# Altium schematic sheet MainboardPCB.SchDoc
size 863 x 558 mm; SheetNumber: 1; SheetTotal: 1
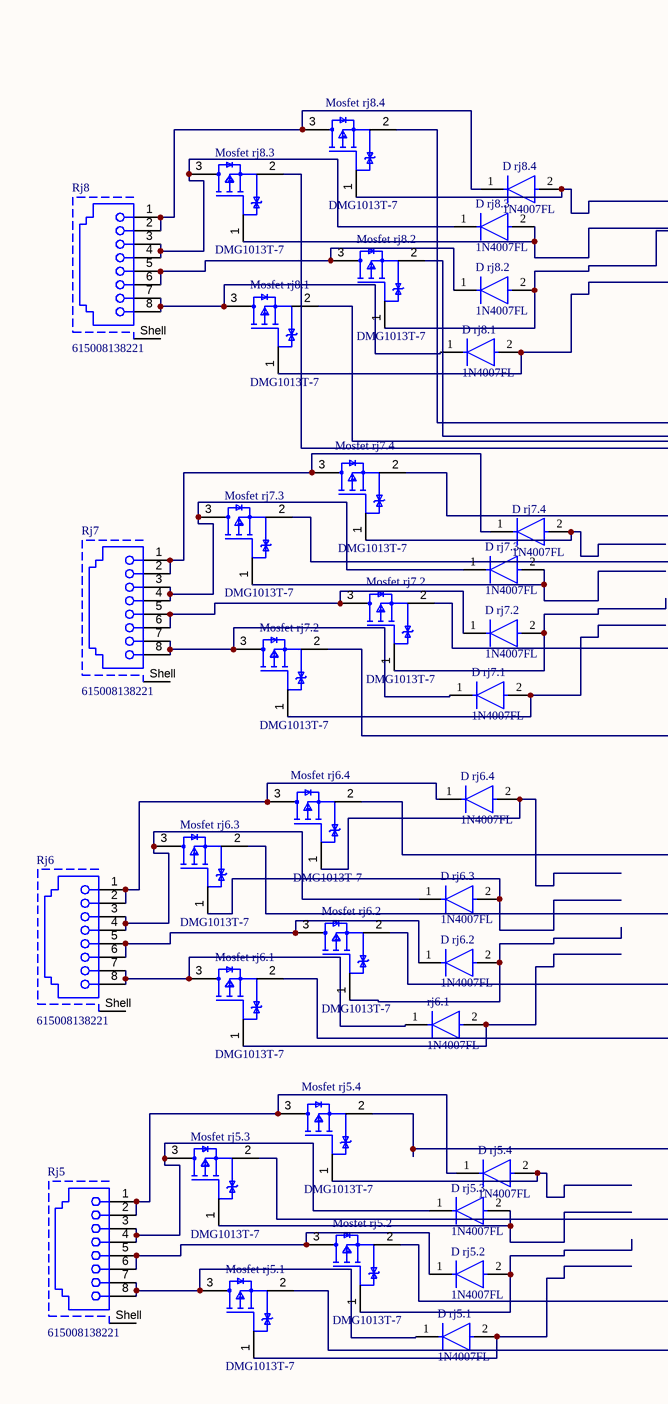
[diagram p0: MainboardPCB.SchDoc, top left]
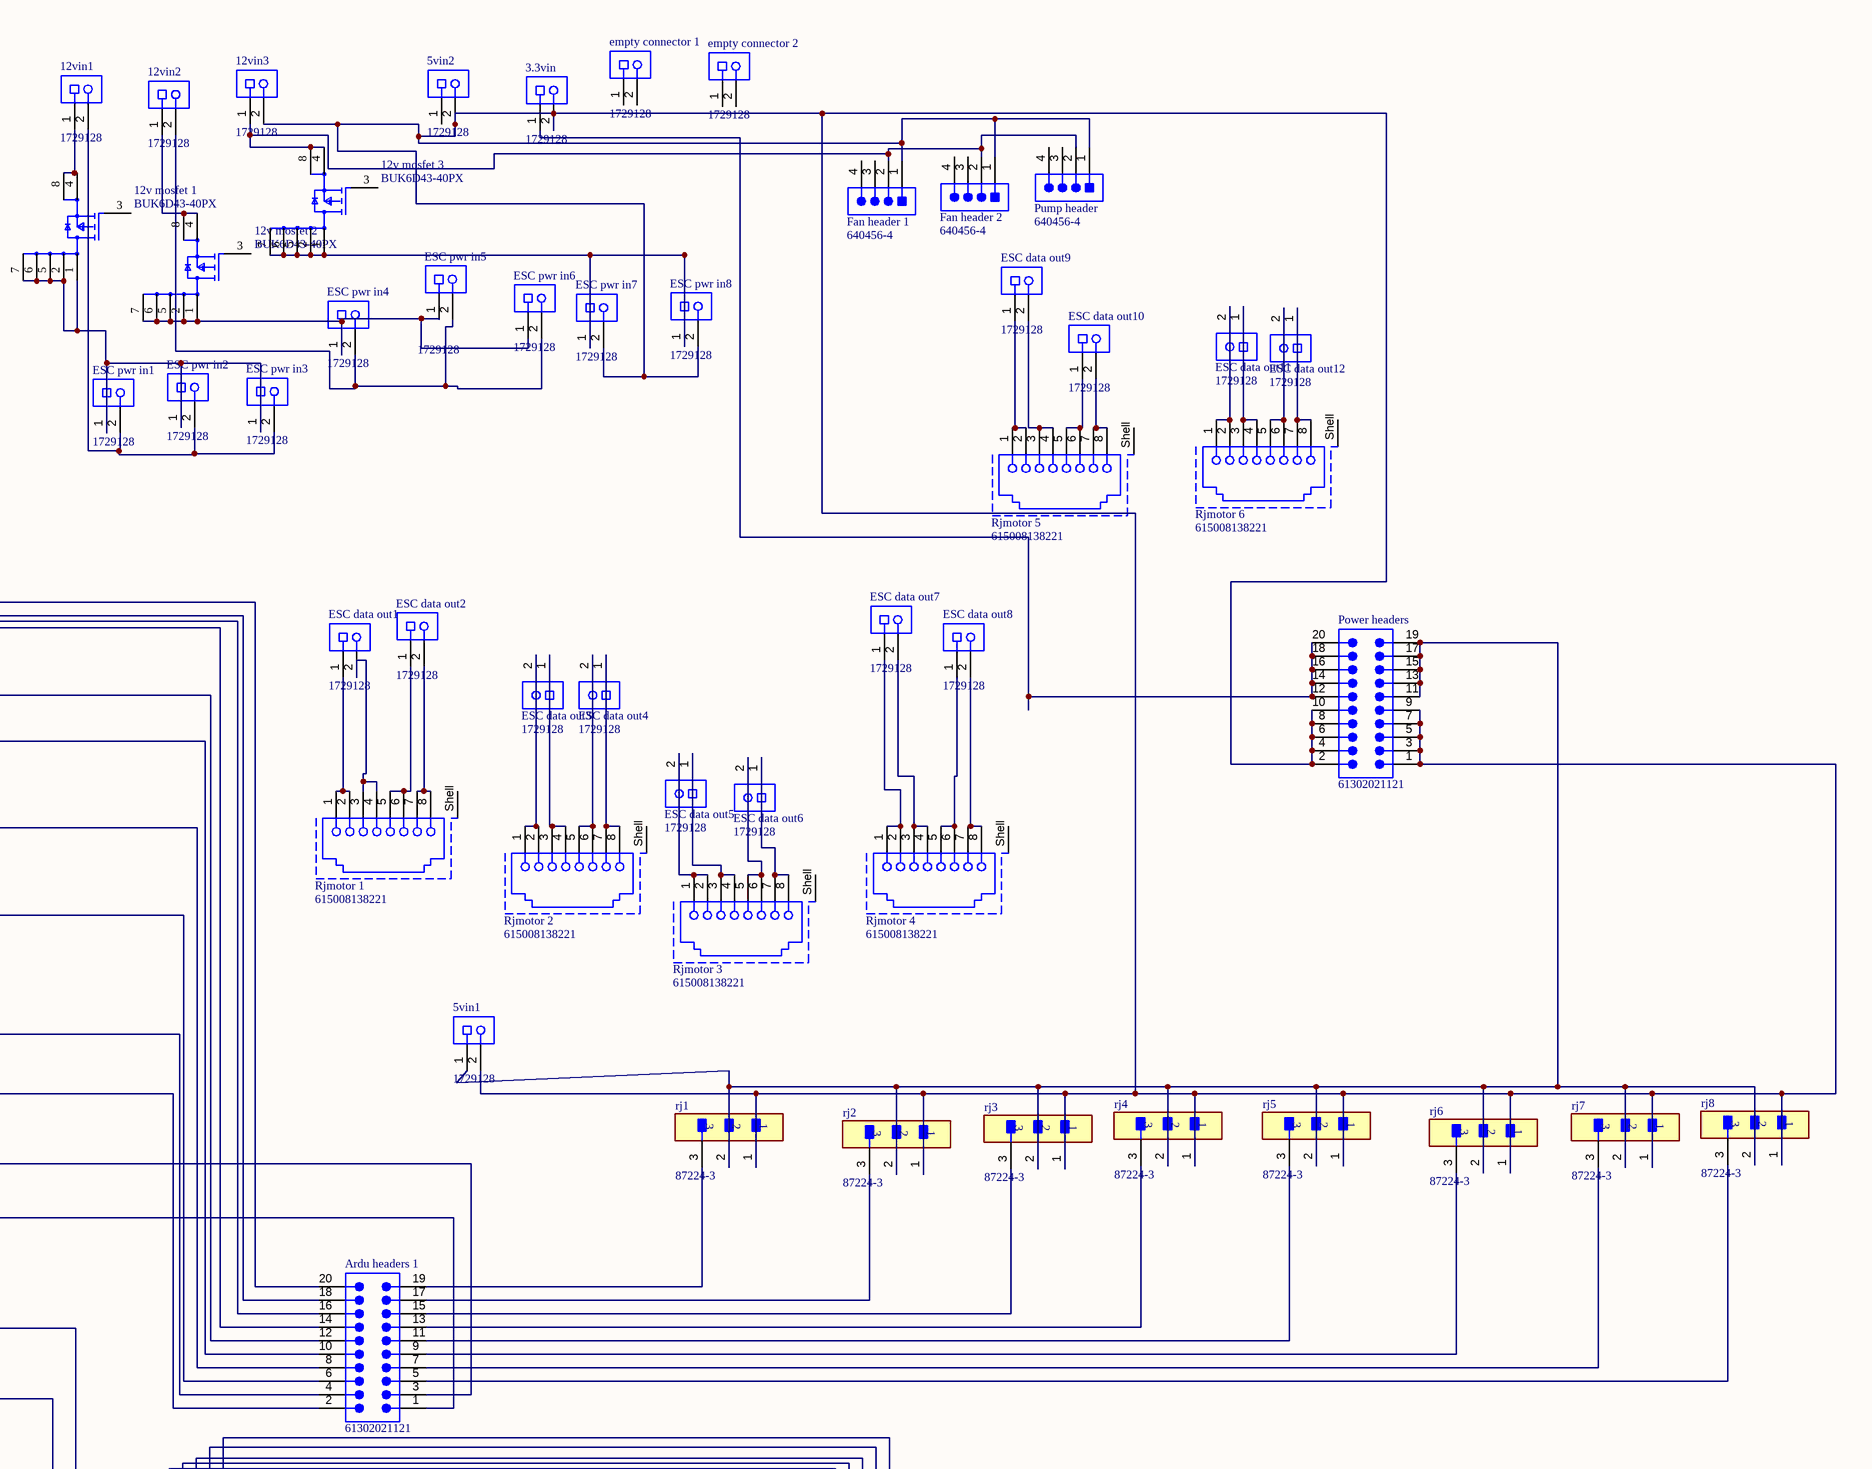
[diagram p1: MainboardPCB.SchDoc, top right]
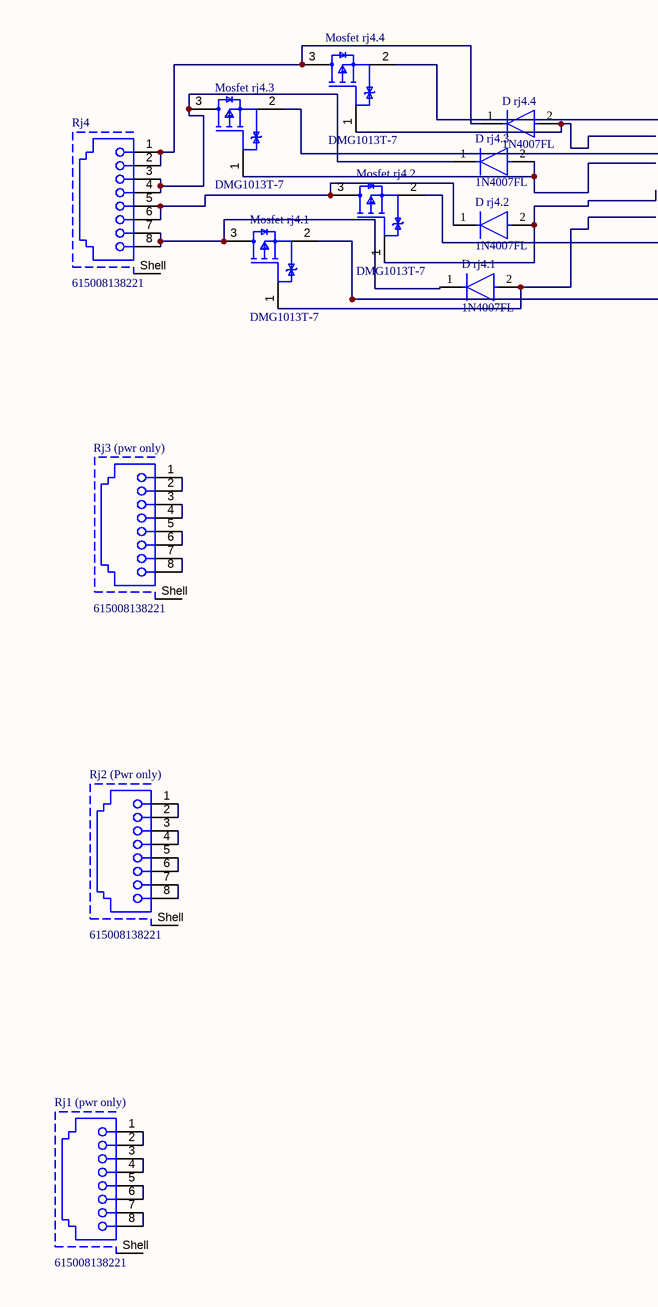
[diagram p2: MainboardPCB.SchDoc, bottom left]
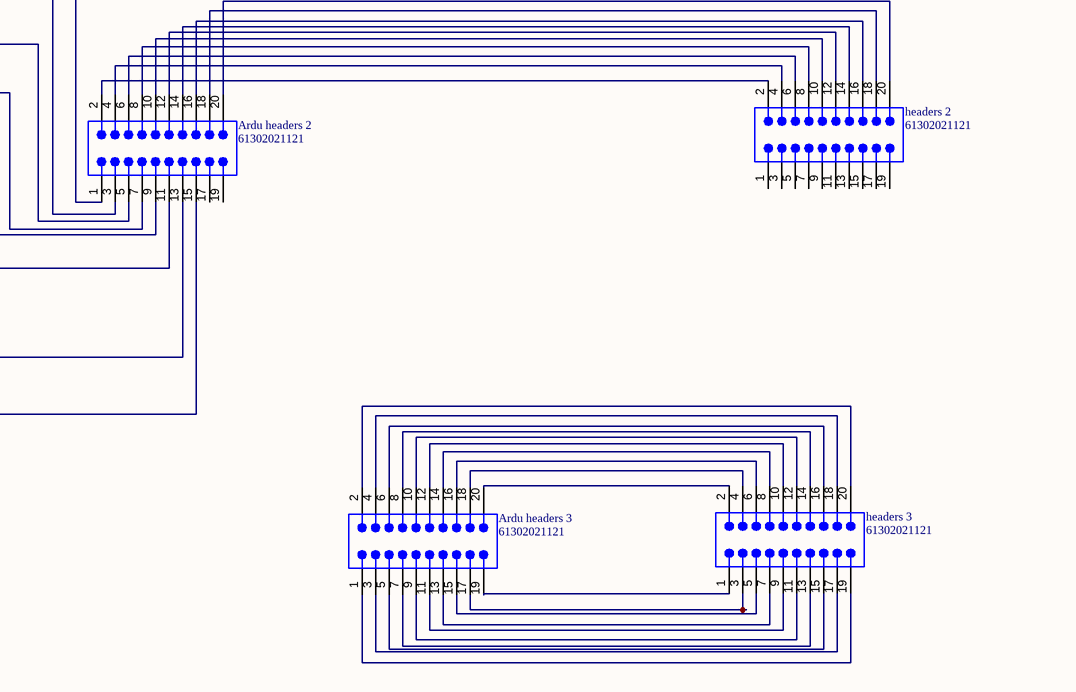
[diagram p3: MainboardPCB.SchDoc, bottom right]

## Parts
(Parts that share a designator on the sheet are numbered #1, #2 ... from top to bottom, then left to right.)
3.3vin  1729128  [PHOE-1729128-2_V]
5vin1  1729128  [PHOE-1729128-2_V]
5vin2  1729128  [PHOE-1729128-2_V]
12v_mosfet_1  BUK6D43-40PX  [FP-SOT1220-MFG]
12v_mosfet_2  BUK6D43-40PX  [FP-SOT1220-MFG]
12v_mosfet_3  BUK6D43-40PX  [FP-SOT1220-MFG]
12vin1  1729128  [PHOE-1729128-2_V]
12vin2  1729128  [PHOE-1729128-2_V]
12vin3  1729128  [PHOE-1729128-2_V]
Ardu_headers_1  61302021121  [61302021121]
Ardu_headers_2  61302021121  [61302021121]
Ardu_headers_3  61302021121  [61302021121]
D_rj4.1  1N4007FL  [FP-1N4007FL-MFG]
D_rj4.2  1N4007FL  [FP-1N4007FL-MFG]
D_rj4.3  1N4007FL  [FP-1N4007FL-MFG]
D_rj4.4  1N4007FL  [FP-1N4007FL-MFG]
D_rj5.1  1N4007FL  [FP-1N4007FL-MFG]
D_rj5.2  1N4007FL  [FP-1N4007FL-MFG]
D_rj5.3  1N4007FL  [FP-1N4007FL-MFG]
D_rj5.4  1N4007FL  [FP-1N4007FL-MFG]
D_rj6.2  1N4007FL  [FP-1N4007FL-MFG]
D_rj6.3  1N4007FL  [FP-1N4007FL-MFG]
D_rj6.4  1N4007FL  [FP-1N4007FL-MFG]
D_rj7.1  1N4007FL  [FP-1N4007FL-MFG]
D_rj7.2  1N4007FL  [FP-1N4007FL-MFG]
D_rj7.3  1N4007FL  [FP-1N4007FL-MFG]
D_rj7.4  1N4007FL  [FP-1N4007FL-MFG]
D_rj8.1  1N4007FL  [FP-1N4007FL-MFG]
D_rj8.2  1N4007FL  [FP-1N4007FL-MFG]
D_rj8.3  1N4007FL  [FP-1N4007FL-MFG]
D_rj8.4  1N4007FL  [FP-1N4007FL-MFG]
empty_connector_1  1729128  [PHOE-1729128-2_V]
empty_connector_2  1729128  [PHOE-1729128-2_V]
ESC_data_out1  1729128  [PHOE-1729128-2_V]
ESC_data_out2  1729128  [PHOE-1729128-2_V]
ESC_data_out3  1729128  [PHOE-1729128-2_V]
ESC_data_out4  1729128  [PHOE-1729128-2_V]
ESC_data_out5  1729128  [PHOE-1729128-2_V]
ESC_data_out6  1729128  [PHOE-1729128-2_V]
ESC_data_out7  1729128  [PHOE-1729128-2_V]
ESC_data_out8  1729128  [PHOE-1729128-2_V]
ESC_data_out9  1729128  [PHOE-1729128-2_V]
ESC_data_out10  1729128  [PHOE-1729128-2_V]
ESC_data_out11  1729128  [PHOE-1729128-2_V]
ESC_data_out12  1729128  [PHOE-1729128-2_V]
ESC_pwr_in1  1729128  [PHOE-1729128-2_V]
ESC_pwr_in2  1729128  [PHOE-1729128-2_V]
ESC_pwr_in3  1729128  [PHOE-1729128-2_V]
ESC_pwr_in4  1729128  [PHOE-1729128-2_V]
ESC_pwr_in5  1729128  [PHOE-1729128-2_V]
ESC_pwr_in6  1729128  [PHOE-1729128-2_V]
ESC_pwr_in7  1729128  [PHOE-1729128-2_V]
ESC_pwr_in8  1729128  [PHOE-1729128-2_V]
Fan_header_1  640456-4  [TECO-640456-4]
Fan_header_2  640456-4  [TECO-640456-4]
headers_2  61302021121  [61302021121]
headers_3  61302021121  [61302021121]
Mosfet_rj4.1  DMG1013T-7  [FP-SOT523-IPC_B]
Mosfet_rj4.2  DMG1013T-7  [FP-SOT523-IPC_B]
Mosfet_rj4.3  DMG1013T-7  [FP-SOT523-IPC_B]
Mosfet_rj4.4  DMG1013T-7  [FP-SOT523-IPC_B]
Mosfet_rj5.1  DMG1013T-7  [FP-SOT523-IPC_B]
Mosfet_rj5.2  DMG1013T-7  [FP-SOT523-IPC_B]
Mosfet_rj5.3  DMG1013T-7  [FP-SOT523-IPC_B]
Mosfet_rj5.4  DMG1013T-7  [FP-SOT523-IPC_B]
Mosfet_rj6.1  DMG1013T-7  [FP-SOT523-IPC_B]
Mosfet_rj6.2  DMG1013T-7  [FP-SOT523-IPC_B]
Mosfet_rj6.3  DMG1013T-7  [FP-SOT523-IPC_B]
Mosfet_rj6.4  DMG1013T-7  [FP-SOT523-IPC_B]
Mosfet_rj7.2#1  DMG1013T-7  [FP-SOT523-IPC_B]
Mosfet_rj7.2#2  DMG1013T-7  [FP-SOT523-IPC_B]
Mosfet_rj7.3  DMG1013T-7  [FP-SOT523-IPC_B]
Mosfet_rj7.4  DMG1013T-7  [FP-SOT523-IPC_B]
Mosfet_rj8.1  DMG1013T-7  [FP-SOT523-IPC_B]
Mosfet_rj8.2  DMG1013T-7  [FP-SOT523-IPC_B]
Mosfet_rj8.3  DMG1013T-7  [FP-SOT523-IPC_B]
Mosfet_rj8.4  DMG1013T-7  [FP-SOT523-IPC_B]
Power_headers  61302021121  [61302021121]
Pump_header  640456-4  [TECO-640456-4]
rj1  87224-3  [FP-87224-3-MFG]
Rj1_(pwr_only)  615008138221  [615008138221]
rj2  87224-3  [FP-87224-3-MFG]
Rj2_(Pwr_only)  615008138221  [615008138221]
rj3  87224-3  [FP-87224-3-MFG]
Rj3_(pwr_only)  615008138221  [615008138221]
rj4#1  87224-3  [FP-87224-3-MFG]
Rj4#2  615008138221  [615008138221]
rj5#1  87224-3  [FP-87224-3-MFG]
Rj5#2  615008138221  [615008138221]
Rj6#1  615008138221  [615008138221]
rj6#2  87224-3  [FP-87224-3-MFG]
rj6.1  1N4007FL  [FP-1N4007FL-MFG]
Rj7#1  615008138221  [615008138221]
rj7#2  87224-3  [FP-87224-3-MFG]
Rj8#1  615008138221  [615008138221]
rj8#2  87224-3  [FP-87224-3-MFG]
Rjmotor_1  615008138221  [615008138221]
Rjmotor_2  615008138221  [615008138221]
Rjmotor_3  615008138221  [615008138221]
Rjmotor_4  615008138221  [615008138221]
Rjmotor_5  615008138221  [615008138221]
Rjmotor_6  615008138221  [615008138221]

## Nets
Net3.3vin_1: 3.3vin.1 Power_headers.12 Power_headers.14 Power_headers.16 Power_headers.18 Power_headers.20
Net3.3vin_2: 3.3vin.2 5vin1.2 5vin2.2 12vin3.2 ESC_pwr_in7.2 ESC_pwr_in8.2 Fan_header_1.1 Fan_header_2.1 Power_headers.1 Power_headers.2 Power_headers.3 Power_headers.4 Power_headers.5 Power_headers.6 Power_headers.7 Power_headers.8 Power_headers.9 Power_headers.10 Pump_header.1 rj1.1 rj2.1 rj3.1 rj4#1.1 rj5#1.1 rj6#2.1 rj7#2.1 rj8#2.1
Net5vin1_1: 5vin1.1 Power_headers.11 Power_headers.13 Power_headers.15 Power_headers.17 Power_headers.19 rj1.2 rj2.2 rj3.2 rj4#1.2 rj5#1.2 rj6#2.2 rj7#2.2 rj8#2.2
Net12v_mosfet_1_1: 12v_mosfet_1.1(D) 12v_mosfet_1.2(D) 12v_mosfet_1.5(D) 12v_mosfet_1.6(D) 12v_mosfet_1.7(D) ESC_pwr_in1.1 ESC_pwr_in2.1 ESC_pwr_in3.1
Net12v_mosfet_1_4: 12v_mosfet_1.4(S) 12v_mosfet_1.8(S) 12vin1.1
Net12v_mosfet_2_1: 12v_mosfet_2.1(D) 12v_mosfet_2.2(D) 12v_mosfet_2.5(D) 12v_mosfet_2.6(D) 12v_mosfet_2.7(D) ESC_pwr_in4.1 ESC_pwr_in5.1 ESC_pwr_in6.1
Net12v_mosfet_2_4: 12v_mosfet_2.4(S) 12v_mosfet_2.8(S) 12vin2.1
Net12v_mosfet_3_1: 12v_mosfet_3.1(D) 12v_mosfet_3.2(D) 12v_mosfet_3.5(D) 12v_mosfet_3.6(D) 12v_mosfet_3.7(D) ESC_pwr_in7.1 ESC_pwr_in8.1
Net12v_mosfet_3_4: 12v_mosfet_3.4(S) 12v_mosfet_3.8(S) 12vin3.1 Fan_header_1.2 Fan_header_2.2 Pump_header.2
Net12vin1_2: 12vin1.2 ESC_pwr_in1.2 ESC_pwr_in2.2 ESC_pwr_in3.2
Net12vin2_2: 12vin2.2 ESC_pwr_in4.2 ESC_pwr_in5.2 ESC_pwr_in6.2
NetArdu_headers_1_1: Ardu_headers_1.1 Mosfet_rj6.1.2(S)
NetArdu_headers_1_2: Ardu_headers_1.2 Mosfet_rj6.3.2(S)
NetArdu_headers_1_3: Ardu_headers_1.3 Mosfet_rj6.2.2(S)
NetArdu_headers_1_4: Ardu_headers_1.4 Mosfet_rj6.4.2(S)
NetArdu_headers_1_5: Ardu_headers_1.5 rj8#2.3
NetArdu_headers_1_6: Ardu_headers_1.6 Mosfet_rj7.2#2.2(S)
NetArdu_headers_1_7: Ardu_headers_1.7 rj7#2.3
NetArdu_headers_1_8: Ardu_headers_1.8 Mosfet_rj7.2#1.2(S)
NetArdu_headers_1_9: Ardu_headers_1.9 rj6#2.3
NetArdu_headers_1_10: Ardu_headers_1.10 Mosfet_rj7.3.2(S)
NetArdu_headers_1_11: Ardu_headers_1.11 rj5#1.3
NetArdu_headers_1_12: Ardu_headers_1.12 Mosfet_rj7.4.2(S)
NetArdu_headers_1_13: Ardu_headers_1.13 rj4#1.3
NetArdu_headers_1_14: Ardu_headers_1.14 Mosfet_rj8.3.2(S)
NetArdu_headers_1_15: Ardu_headers_1.15 rj3.3
NetArdu_headers_1_16: Ardu_headers_1.16 Mosfet_rj8.1.2(S)
NetArdu_headers_1_17: Ardu_headers_1.17 rj2.3
NetArdu_headers_1_18: Ardu_headers_1.18 Mosfet_rj8.2.2(S)
NetArdu_headers_1_19: Ardu_headers_1.19 rj1.3
NetArdu_headers_1_20: Ardu_headers_1.20 Mosfet_rj8.4.2(S)
NetArdu_headers_2_1: Ardu_headers_2.1 Mosfet_rj5.4.2(S)
NetArdu_headers_2_2: Ardu_headers_2.2 headers_2.2
NetArdu_headers_2_3: Ardu_headers_2.3 Mosfet_rj5.3.2(S)
NetArdu_headers_2_4: Ardu_headers_2.4 headers_2.4
NetArdu_headers_2_5: Ardu_headers_2.5 Mosfet_rj5.2.2(S)
NetArdu_headers_2_6: Ardu_headers_2.6 headers_2.6
NetArdu_headers_2_7: Ardu_headers_2.7 Mosfet_rj5.1.2(S)
NetArdu_headers_2_8: Ardu_headers_2.8 headers_2.8
NetArdu_headers_2_9: Ardu_headers_2.9 Mosfet_rj4.4.2(S)
NetArdu_headers_2_10: Ardu_headers_2.10 headers_2.10
NetArdu_headers_2_11: Ardu_headers_2.11 Mosfet_rj4.3.2(S)
NetArdu_headers_2_12: Ardu_headers_2.12 headers_2.12
NetArdu_headers_2_13: Ardu_headers_2.13 Mosfet_rj4.2.2(S)
NetArdu_headers_2_14: Ardu_headers_2.14 headers_2.14
NetArdu_headers_2_15: Ardu_headers_2.15 Mosfet_rj4.1.2(S)
NetArdu_headers_2_16: Ardu_headers_2.16 headers_2.16
NetArdu_headers_2_18: Ardu_headers_2.18 headers_2.18
NetArdu_headers_2_20: Ardu_headers_2.20 headers_2.20
NetArdu_headers_3_1: Ardu_headers_3.1 headers_3.19
NetArdu_headers_3_2: Ardu_headers_3.2 headers_3.20
NetArdu_headers_3_3: Ardu_headers_3.3 headers_3.17
NetArdu_headers_3_4: Ardu_headers_3.4 headers_3.18
NetArdu_headers_3_5: Ardu_headers_3.5 headers_3.15
NetArdu_headers_3_6: Ardu_headers_3.6 headers_3.16
NetArdu_headers_3_7: Ardu_headers_3.7 headers_3.13
NetArdu_headers_3_8: Ardu_headers_3.8 headers_3.14
NetArdu_headers_3_9: Ardu_headers_3.9 headers_3.11
NetArdu_headers_3_10: Ardu_headers_3.10 headers_3.12
NetArdu_headers_3_11: Ardu_headers_3.11 headers_3.9
NetArdu_headers_3_12: Ardu_headers_3.12 headers_3.10
NetArdu_headers_3_13: Ardu_headers_3.13 headers_3.7
NetArdu_headers_3_14: Ardu_headers_3.14 headers_3.8
NetArdu_headers_3_15: Ardu_headers_3.15 headers_3.5
NetArdu_headers_3_16: Ardu_headers_3.16 headers_3.6
NetArdu_headers_3_17: Ardu_headers_3.17 headers_3.3
NetArdu_headers_3_18: Ardu_headers_3.18 headers_3.4
NetArdu_headers_3_19: Ardu_headers_3.19 headers_3.1
NetArdu_headers_3_20: Ardu_headers_3.20 headers_3.2
NetD_rj4.1_1: D_rj4.1.1(C) Mosfet_rj4.1.3(D) Rj4#2.7 Rj4#2.8
NetD_rj4.1_2: D_rj4.1.2(A) Mosfet_rj4.1.1(G)
NetD_rj4.2_1: D_rj4.2.1(C) Mosfet_rj4.2.3(D) Rj4#2.5 Rj4#2.6
NetD_rj4.2_2: D_rj4.2.2(A) Mosfet_rj4.2.1(G)
NetD_rj4.3_1: D_rj4.3.1(C) Mosfet_rj4.3.3(D) Rj4#2.3 Rj4#2.4
NetD_rj4.3_2: D_rj4.3.2(A) Mosfet_rj4.3.1(G)
NetD_rj4.4_1: D_rj4.4.1(C) Mosfet_rj4.4.3(D) Rj4#2.1 Rj4#2.2
NetD_rj4.4_2: D_rj4.4.2(A) Mosfet_rj4.4.1(G)
NetD_rj5.1_1: D_rj5.1.1(C) Mosfet_rj5.1.3(D) Rj5#2.7 Rj5#2.8
NetD_rj5.1_2: D_rj5.1.2(A) Mosfet_rj5.1.1(G)
NetD_rj5.2_1: D_rj5.2.1(C) Mosfet_rj5.2.3(D) Rj5#2.5 Rj5#2.6
NetD_rj5.2_2: D_rj5.2.2(A) Mosfet_rj5.2.1(G)
NetD_rj5.3_1: D_rj5.3.1(C) Mosfet_rj5.3.3(D) Rj5#2.3 Rj5#2.4
NetD_rj5.3_2: D_rj5.3.2(A) Mosfet_rj5.3.1(G)
NetD_rj5.4_1: D_rj5.4.1(C) Mosfet_rj5.4.3(D) Rj5#2.1 Rj5#2.2
NetD_rj5.4_2: D_rj5.4.2(A) Mosfet_rj5.4.1(G)
NetD_rj6.2_1: D_rj6.2.1(C) Mosfet_rj6.2.3(D) Rj6#1.5 Rj6#1.6
NetD_rj6.2_2: D_rj6.2.2(A) Mosfet_rj6.2.1(G)
NetD_rj6.3_1: D_rj6.3.1(C) Mosfet_rj6.3.3(D) Rj6#1.3 Rj6#1.4
NetD_rj6.3_2: D_rj6.3.2(A) Mosfet_rj6.3.1(G)
NetD_rj6.4_1: D_rj6.4.1(C) Mosfet_rj6.4.3(D) Rj6#1.1 Rj6#1.2
NetD_rj6.4_2: D_rj6.4.2(A) Mosfet_rj6.4.1(G)
NetD_rj7.1_1: D_rj7.1.1(C) Mosfet_rj7.2#2.3(D) Rj7#1.7 Rj7#1.8
NetD_rj7.1_2: D_rj7.1.2(A) Mosfet_rj7.2#2.1(G)
NetD_rj7.2_1: D_rj7.2.1(C) Mosfet_rj7.2#1.3(D) Rj7#1.5 Rj7#1.6
NetD_rj7.2_2: D_rj7.2.2(A) Mosfet_rj7.2#1.1(G)
NetD_rj7.3_1: D_rj7.3.1(C) Mosfet_rj7.3.3(D) Rj7#1.3 Rj7#1.4
NetD_rj7.3_2: D_rj7.3.2(A) Mosfet_rj7.3.1(G)
NetD_rj7.4_1: D_rj7.4.1(C) Mosfet_rj7.4.3(D) Rj7#1.1 Rj7#1.2
NetD_rj7.4_2: D_rj7.4.2(A) Mosfet_rj7.4.1(G)
NetD_rj8.1_1: D_rj8.1.1(C) Mosfet_rj8.1.3(D) Rj8#1.7 Rj8#1.8
NetD_rj8.1_2: D_rj8.1.2(A) Mosfet_rj8.1.1(G)
NetD_rj8.2_1: D_rj8.2.1(C) Mosfet_rj8.2.3(D) Rj8#1.5 Rj8#1.6
NetD_rj8.2_2: D_rj8.2.2(A) Mosfet_rj8.2.1(G)
NetD_rj8.3_1: D_rj8.3.1(C) Mosfet_rj8.3.3(D) Rj8#1.3 Rj8#1.4
NetD_rj8.3_2: D_rj8.3.2(A) Mosfet_rj8.3.1(G)
NetD_rj8.4_1: D_rj8.4.1(C) Mosfet_rj8.4.3(D) Rj8#1.1 Rj8#1.2
NetD_rj8.4_2: D_rj8.4.2(A) Mosfet_rj8.4.1(G)
NetESC_data_out1_1: ESC_data_out1.1 Rjmotor_1.1 Rjmotor_1.2
NetESC_data_out1_2: ESC_data_out1.2 Rjmotor_1.3 Rjmotor_1.4
NetESC_data_out2_1: ESC_data_out2.1 Rjmotor_1.5 Rjmotor_1.6
NetESC_data_out2_2: ESC_data_out2.2 Rjmotor_1.7 Rjmotor_1.8
NetESC_data_out3_1: ESC_data_out3.1 Rjmotor_2.3 Rjmotor_2.4
NetESC_data_out3_2: ESC_data_out3.2 Rjmotor_2.1 Rjmotor_2.2
NetESC_data_out4_1: ESC_data_out4.1 Rjmotor_2.7 Rjmotor_2.8
NetESC_data_out4_2: ESC_data_out4.2 Rjmotor_2.5 Rjmotor_2.6
NetESC_data_out5_1: ESC_data_out5.1 Rjmotor_3.3 Rjmotor_3.4
NetESC_data_out5_2: ESC_data_out5.2 Rjmotor_3.1 Rjmotor_3.2
NetESC_data_out6_1: ESC_data_out6.1 Rjmotor_3.7 Rjmotor_3.8
NetESC_data_out6_2: ESC_data_out6.2 Rjmotor_3.5 Rjmotor_3.6
NetESC_data_out7_1: ESC_data_out7.1 Rjmotor_4.1 Rjmotor_4.2
NetESC_data_out7_2: ESC_data_out7.2 Rjmotor_4.3 Rjmotor_4.4
NetESC_data_out8_1: ESC_data_out8.1 Rjmotor_4.5 Rjmotor_4.6
NetESC_data_out8_2: ESC_data_out8.2 Rjmotor_4.7 Rjmotor_4.8
NetESC_data_out9_1: ESC_data_out9.1 Rjmotor_5.1 Rjmotor_5.2
NetESC_data_out9_2: ESC_data_out9.2 Rjmotor_5.3 Rjmotor_5.4
NetESC_data_out10_1: ESC_data_out10.1 Rjmotor_5.5 Rjmotor_5.6
NetESC_data_out10_2: ESC_data_out10.2 Rjmotor_5.7 Rjmotor_5.8
NetESC_data_out11_1: ESC_data_out11.1 Rjmotor_6.3 Rjmotor_6.4
NetESC_data_out11_2: ESC_data_out11.2 Rjmotor_6.1 Rjmotor_6.2
NetESC_data_out12_1: ESC_data_out12.1 Rjmotor_6.7 Rjmotor_6.8
NetESC_data_out12_2: ESC_data_out12.2 Rjmotor_6.5 Rjmotor_6.6
NetMosfet_rj6.1_1: Mosfet_rj6.1.1(G) rj6.1.2(A)
NetMosfet_rj6.1_3: Mosfet_rj6.1.3(D) Rj6#1.7 Rj6#1.8 rj6.1.1(C)
NetRj1_(pwr_only)_1: Rj1_(pwr_only).1 Rj1_(pwr_only).2
NetRj1_(pwr_only)_3: Rj1_(pwr_only).3 Rj1_(pwr_only).4
NetRj1_(pwr_only)_5: Rj1_(pwr_only).5 Rj1_(pwr_only).6
NetRj1_(pwr_only)_7: Rj1_(pwr_only).7 Rj1_(pwr_only).8
NetRj2_(Pwr_only)_1: Rj2_(Pwr_only).1 Rj2_(Pwr_only).2
NetRj2_(Pwr_only)_3: Rj2_(Pwr_only).3 Rj2_(Pwr_only).4
NetRj2_(Pwr_only)_5: Rj2_(Pwr_only).5 Rj2_(Pwr_only).6
NetRj2_(Pwr_only)_7: Rj2_(Pwr_only).7 Rj2_(Pwr_only).8
NetRj3_(pwr_only)_1: Rj3_(pwr_only).1 Rj3_(pwr_only).2
NetRj3_(pwr_only)_3: Rj3_(pwr_only).3 Rj3_(pwr_only).4
NetRj3_(pwr_only)_5: Rj3_(pwr_only).5 Rj3_(pwr_only).6
NetRj3_(pwr_only)_7: Rj3_(pwr_only).7 Rj3_(pwr_only).8

Not connected (* = marked no-connect by the designer): 5vin2 1; 12v_mosfet_1 3(G); 12v_mosfet_2 3(G); 12v_mosfet_3 3(G); Ardu_headers_2 17 19; empty_connector_1 1 2; empty_connector_2 1 2; Fan_header_1 3 4; Fan_header_2 3 4; headers_2 1 3 5 7 9 11 13 15 17 19; Pump_header 3 4; Rj1_(pwr_only) Shell; Rj2_(Pwr_only) Shell; Rj3_(pwr_only) Shell; Rj4#2 Shell; Rj5#2 Shell; Rj6#1 Shell; Rj7#1 Shell; Rj8#1 Shell; Rjmotor_1 Shell; Rjmotor_2 Shell; Rjmotor_3 Shell; Rjmotor_4 Shell; Rjmotor_5 Shell; Rjmotor_6 Shell

## Notes on the sheet
- DWG. NO.
- REV.
- SHT.
- REVISION
- DESCRIPTION
- DATE
- APPROVED
- THIS DOCUMENT AND THE DATA DISCLOSED HEREIN OR HEREWITH IS THE PROPERTY OF ALTIUM LIMITED AND MAY BE FREELY DISTRIBUTED IN WHOLE. NO RIGHTS ARE RESERVED OR EXPRESS OR IMPLIED WARANTEE GIVEN.
- ENG:
- DSN:
- APPROVALS
- PROJECT
- DOCUMENT REVISION:
- DESIGN ITEM:
- CHK:
- BOM:
- REFERENCE DOCUMENTS
- PROJECT REVISION:
- TITLE
- FAB DWG:
- PCB DWG:
- ASSY DWG:
- SCALE:
- SIZE
- D
- CAGE CODE
- FILE NAME
- DWG NO.
- SHEET
- OF
- REV

## Library data of the parts
3.3vin 5vin1 5vin2 12vin1-12vin3 empty_connector_1 empty_connector_2 ESC_data_out1-ESC_data_out12 ESC_pwr_in1-ESC_pwr_in8 = CMP-2000-05815-1: PCB Terminal Block, 13.5 A, 400 V, 2-Pin THD, RoHS, Bulk; Manufacturer: Phoenix Contact; Package Version: 03/2015; No. of Rows: 1; Pitch: 5.08mm; No. of Positions: 2; Voltage Rating: 400V; Current Rating: 13500mA; Manufacturer URL: http://www.phoenixcontact.com/; Datasheet URL: https://datasheet.ciiva.com/16046/1729128-16046181.pdf; RoHS: TRUE; Package URL: https://www.phoenixcontact.com/online/portal/pi/pxc/product_detail_page/!ut/p/b1/3VdJjqNKFDxLH8AFycySyWY2ozFsEPOMMQaDOX1XedGL_1Vdm5YXJleknhSKeBkvI6EA8ncAo3AYoDhBQGco6KN7VURTdemj9us_IEKEZo_YHiPAEWEFmDGOHMORkqKYCORBZxgL7ZoaZYcbFFUZ3fqxSY6GOuxydWUuHqz1ynmMFygu583Bob0Ewr6Sd_l-5m-kAueHiB0jpRwZwe58wwtkpxtMYd_LmGcDRU02dRNEyWt6Y2ti5pSyJ_reIkzIulrqApdnbT11V5jnCKbYNCvhEM1MCpPByat_X379-iThf08CI5GfOPqfBeS3BRoBOdD55AKVv0iLwCMq-2BrzXWSGRH7pUGD9uwXQjiph3xL0DKQwdGa0JImiIOmBNOestqgwTHSSs2oOep-78apyXQBvNi8ZLaFjvjWvcaUEBu0MC6Wbe-d6mB0FAebo2lUWinqYaZs5DAYzV0RP9yitUjnGJ0iI9xhZkT42OCQNUJJhkgWINNQLP2JFP6OpMg3JCVg70jqHT0lvKOnhHf0lPuOnnLf0VPuWx6_dxwUIvwk5WMkT0kLL1mh61l2yZVSzG3pYV_bqo-mj6uMKwKwdnnW8Jh5RTOJzMOA5c-eJDaZQw4mTMPH02PvS_ZAqNVjVTo2WyYLkwH_KU1mmmG5kjRhDqPXLwwVHvVOjCM60-fpXvTDfMGW1PVFVS1r4e4yVDk4ZdNbkUHvqPqQSeian4UD39fNKmachqdJ1NJbyk8rXT9mXTvPk3oE5meulKGgiruPJek-4I9hTT6G8ZLOyRSm2RRVbThERQad5OS28hdt4YW4vG0stgYYzsWsK4_7y6DZMjJSCqri1kyiZR5vD7pwIrNR7QwPHTcLTI5qT7eRlpHrdGiupYlqQDJ7zy_CND8fWWBoLRXxk1RVcXiBQwbTD4Xi7KL-FuO94t9xaqweXzH; PartNumber: 1729128; Package Description: 2-Pin Through Hole Device, Body 8.1 x 10.16 mm, Pitch 5.08 mm; Datasheet Version: 12/2013; Mounting Technology: ThroughHole; Orientation: Horizontal; Package Reference: 1729128-2; Packing: Bulk
12v_mosfet_1-12v_mosfet_3 = CMP-11424-88017679-1: BUK6D43-40PX Mosfet, Aec-Q101, P-Ch, -40V, Sot-1220; Rohs Compliant: Yes; Manufacturer Lifecycle Status: RELEASED FOR SUPPLY; Schedule B: 8541290080; RoHS: Non-Compliant; Lifecycle Status: Production; NexarPartId: 88017679
Ardu_headers_1-Ardu_headers_3 headers_2 headers_3 Power_headers = CMP-1502-01104-3: NexarPartId: 32855556; Current Rating: 3A; Operating Supply Voltage: 250V; Contact Resistance: 20mΩ; Gender: Male; Number of Positions: 20; Connector Type: Male Pin; Row Spacing: 2.54mm; Contact Material: Copper; Number of Rows: 2; Lead Pitch: 2.54mm; Packaging: Bulk; Mount: Through Hole; Number of Pins: 20; Contact Mating Length: 5.9944mm; Number of Contacts: 20; Pitch: 2.54mm; Color: Black; Contact Plating: Gold; Orientation: Vertical; Termination: Solder; REACH SVHC: Unknown; RoHS: Compliant
D_rj4.1-D_rj4.4 D_rj5.1-D_rj5.4 D_rj6.2-D_rj6.4 D_rj7.1-D_rj7.4 D_rj8.1-D_rj8.4 rj6.1 = CMP-10078-122641204-1: 1N4007FL Diode Gen Purp 1KV 1A SOD123FL; Capacitance: 6pF; Max Junction Temperature (Tj): 150°C; Peak Reverse Current: 5µA; Max Forward Surge Current (Ifsm): 30A; Reverse Voltage: 1kV; Max Operating Temperature: 150°C; Height: 1.1mm; Min Operating Temperature: -55°C; Forward Current: 1A; Max Repetitive Reverse Voltage (Vrrm): 1kV; NexarPartId: 122641204
Fan_header_1 Fan_header_2 Pump_header = CMP-2000-05419-1: Male Header, Pitch 2.54 mm, 1 x 4 Position, Height 10.03 mm, Tail Length 3.56 mm, RoHS, Bulk; Manufacturer: TE Connectivity; Material, Housing: Polyester; Primary Type: InterconnectSystem; Mount Angle: Vertical; Color, Housing: White; Current, Rating: 5 / A; Agency Approvals: CSA,UL; Contact Termination Area Plating: Tin; Temperature, Operating: -55to+105 / degC; Standards: RoHSCompliant,ELVCompliant,UL94V-0; Number of Positions: 4; Brand/Series: MTA-100Series; Angle: Straight; Pin Spacing: 0.1 / "; Material, Contact: CopperAlloy; Connector Type: MTA-100; Special Features: Pinstrip; Mounting Hole Size: 0.04 / "; Contact Centerline Spacing: 0.100 / in.; Voltage, Rating: 250 / V; Manufacturer URL: http://www.te.com/; Length, Pin: 0.14 / "; Length, Overall: 0.4 / "; Color: White; Flammability Rating: UL94V-0; Mounting Type: PCMount; Termination: Solder; Datasheet URL: https://datasheet.ciiva.com/16286/eng-ds-82056-mta-0608-16286228.pdf; Number of Contacts: 4; Contact Shape: Square; Contact Mating Area Plating: Tin; Length, Terminal Post: 0.14 / in.; Size, Post: 0.025 / in.; Contact Plating: Tin; Type: PCBPlug; Datasheet Version: Dec-14; Number of Rows: 1
Mosfet_rj4.1-Mosfet_rj4.4 Mosfet_rj5.1-Mosfet_rj5.4 Mosfet_rj6.1-Mosfet_rj6.4 Mosfet_rj7.2#1 Mosfet_rj7.2#2 Mosfet_rj7.3 Mosfet_rj7.4 Mosfet_rj8.1-Mosfet_rj8.4 = CMP-12801-000011-2: MOSFET P-CH 20V 0.46A SOT-523; Threshold Voltage: -1V; Continuous Drain Current (ID): 460mA; Rise Time: 8.1ns; Turn-Off Delay Time: 28.4ns; Number of Channels: 1; On-State Resistance: 700mR; Power Dissipation: 270mW; Input Capacitance: 59.76pF; Fall Time: 20.7ns; Turn-On Delay Time: 5.1ns; Drain to Source Resistance: 1R; Drain to Source Breakdown Voltage: -20V; Gate to Source Voltage (Vgs): 6V; Element Configuration: Single; Min Operating Temperature: -55°C; Max Operating Temperature: 150°C; Case/Package: SOT-523; Lead Free: Lead Free; Length: 1.7mm; REACH SVHC: No SVHC; Radiation Hardening: No; Number of Pins: 3; Weight: 7.1E-05oz; Rds On Max: 700mR; Height: 0.8mm; Number of Elements: 1; Packaging: Tape and Reel; Mount: Surface Mount; Width: 0.85mm; Drain to Source Voltage (Vdss): 20V; Max Power Dissipation: 270mW; Contact Plating: Tin; Package Quantity: 1
rj1-rj3 rj4#1 rj5#1 rj6#2 rj7#2 rj8#2 = CMP-2000-05697-2: CONN HEADER VERT 3POS 2.54MM; Number of Positions: 3; Gasket: No (Without); High Speed Serial Data Connector: No; Current Rating: 3A; Contact Post Length: 0.125inch; PCB Thickness: 1.397mm; PCB Mount Retention: Without; Connector Type: Plug; Approvals: CSA; PCB Mounting Orientation: Vertical; Pitch: 2.54mm; Mating Alignment: No (Without); Housing Color: Black; Contact Gender: Male; Length: 7.21mm; Max Operating Temperature: 105°C; Strain Relief: No (Without); Contact Material: Bronze; Row Spacing: 2.54mm; Series: AMPMODU MOD II; Board Standoff: No (Without); Package Quantity: 520; Radiation Hardening: No; Contact Protection: No (Without); Stabilizers: No (Without); Number of Rows: 1; Contact Mating Length: 8.08mm; Contact Shape: Square; Depth: 2.54mm; Contact Current Rating: 3A; Flammability Rating: UL94 V-0; Packaging: Carton; Number of Contacts: 3; Orientation: Straight; Mount: Through Hole; Keyed: No; Contact Type: Male Pin; Housing Material: Thermoplastic; High Temperature Housing: No; ELV: Compliant; Contact Plating: Gold; Termination: Through Hole; Selectively Loaded: No (Without); Lead Free: Lead Free; Min Operating Temperature: -65°C; Mating Connector Lock: No (Without); Color: Black; RoHS Compliant: Yes
Rj1_(pwr_only) Rj2_(Pwr_only) Rj3_(pwr_only) Rj4#2 Rj5#2 Rj6#1 Rj7#1 Rj8#1 Rjmotor_1-Rjmotor_6 = CMP-1502-01731-2: NexarPartId: 18818181; Direction: User Selectable; Current Rating: 1.5A; Number of Contacts: 8; Contact Resistance: 20mΩ; Connector Type: RJ45, Socket; Number of Ports: 1; Voltage Rating: 125V; Operating Supply Voltage: 120V; Shielding: Shielded; Gender: Female; Insulation Resistance: 500MΩ; REACH SVHC: Unknown; RoHS: Compliant; Color: Black; Depth: 16.4mm; Housing Material: PBT; Width: 15.9mm; Termination: Through Hole; Insulation Material: PBT; Contact Material: Copper; Max Operating Temperature: 85°C; Length: 16.65mm; Contact Plating: Gold; Min Operating Temperature: -40°C; Height: 16.65mm; Mount: Through Hole; Orientation: Vertical; Number of Rows: 1; Number of Positions: 8